# Altium schematic sheet Drivers_V2.SchDoc
size A4
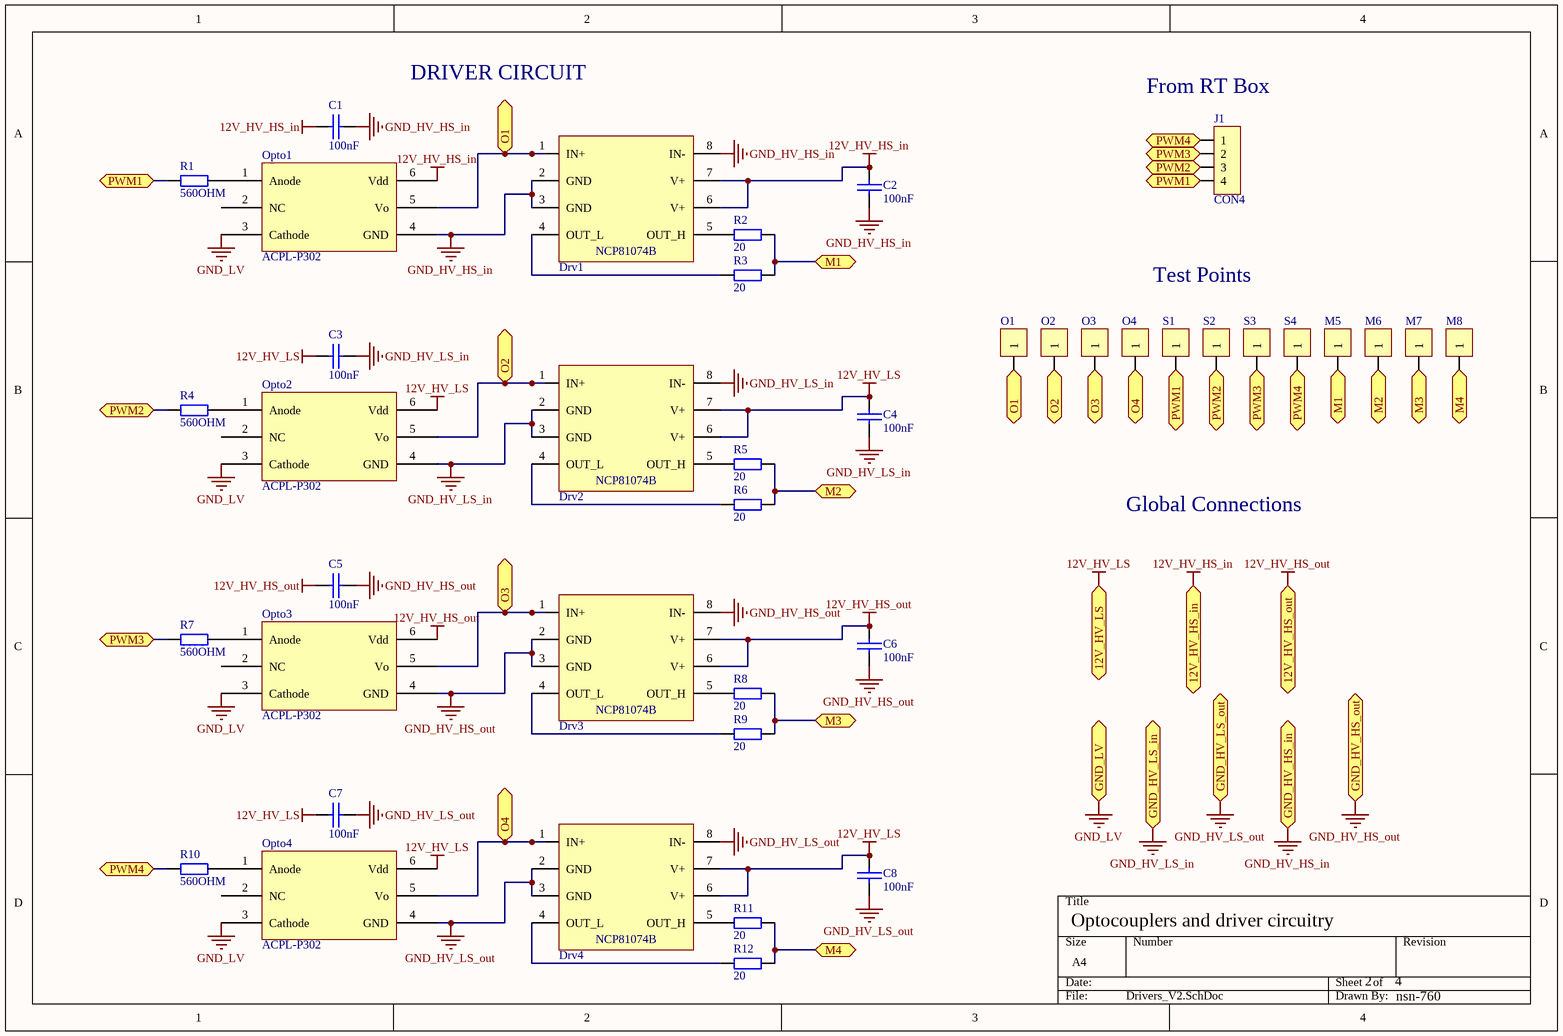
[diagram p0: Drivers_V2.SchDoc]

## Parts
C1  100nF  [1206]
C2  100nF  [1206]
C3  100nF  [1206]
C4  100nF  [1206]
C5  100nF  [1206]
C6  100nF  [1206]
C7  100nF  [1206]
C8  100nF  [1206]
Drv1  NCP81074B  [NCP81074A]  (value not drawn)
Drv2  NCP81074B  [NCP81074A]  (value not drawn)
Drv3  NCP81074B  [NCP81074A]  (value not drawn)
Drv4  NCP81074B  [NCP81074A]  (value not drawn)
J1  CON4  [Con4_Extron _3.5mmPitch]
M5  Test Point  [Test_Point]  (value not drawn)
M6  Test Point  [Test_Point]  (value not drawn)
M7  Test Point  [Test_Point]  (value not drawn)
M8  Test Point  [Test_Point]  (value not drawn)
O1  Test Point  [Test_Point]  (value not drawn)
O2  Test Point  [Test_Point]  (value not drawn)
O3  Test Point  [Test_Point]  (value not drawn)
O4  Test Point  [Test_Point]  (value not drawn)
Opto1  ACPL-P302  [SSOIC6]
Opto2  ACPL-P302  [SSOIC6]
Opto3  ACPL-P302  [SSOIC6]
Opto4  ACPL-P302  [SSOIC6]
R1  560OHM  [1206]
R2  20  [1206]
R3  20  [1206]
R4  560OHM  [1206]
R5  20  [1206]
R6  20  [1206]
R7  560OHM  [1206]
R8  20  [1206]
R9  20  [1206]
R10  560OHM  [1206]
R11  20  [1206]
R12  20  [1206]
S1  Test Point  [Test_Point]  (value not drawn)
S2  Test Point  [Test_Point]  (value not drawn)
S3  Test Point  [Test_Point]  (value not drawn)
S4  Test Point  [Test_Point]  (value not drawn)

## Ports
12V_HV_HS_in, 12V_HV_HS_out, 12V_HV_LS, GND_HV_HS_in, GND_HV_HS_out, GND_HV_LS_in, GND_HV_LS_out, GND_LV, M1, M2, M3, M4, O1, O2, O3, O4, PWM1, PWM2, PWM3, PWM4

## Nets
12V_HV_HS_in: C1.1 C2.1 Drv1.6(V+) Drv1.7(V+) Opto1.6(Vdd) ; port 12V_HV_HS_in
12V_HV_HS_out: C5.1 C6.1 Drv3.6(V+) Drv3.7(V+) Opto3.6(Vdd) ; port 12V_HV_HS_out
12V_HV_LS: C3.1 C4.1 C7.1 C8.1 Drv2.6(V+) Drv2.7(V+) Drv4.6(V+) Drv4.7(V+) Opto2.6(Vdd) Opto4.6(Vdd) ; port 12V_HV_LS
GND_HV_HS_in: C1.2 C2.2 Drv1.2(GND) Drv1.3(GND) Drv1.8(IN-) Opto1.4(GND) ; port GND_HV_HS_in
GND_HV_HS_out: C5.2 C6.2 Drv3.2(GND) Drv3.3(GND) Drv3.8(IN-) Opto3.4(GND) ; port GND_HV_HS_out
GND_HV_LS_in: C3.2 C4.2 Drv2.2(GND) Drv2.3(GND) Drv2.8(IN-) Opto2.4(GND) ; port GND_HV_LS_in
GND_HV_LS_out: C7.2 C8.2 Drv4.2(GND) Drv4.3(GND) Drv4.8(IN-) Opto4.4(GND) ; port GND_HV_LS_out
GND_LV: Opto1.3(Cathode) Opto2.3(Cathode) Opto3.3(Cathode) Opto4.3(Cathode) ; port GND_LV
M1: M5.1 R2.1 R3.1 ; port M1
M2: M6.1 R5.1 R6.1 ; port M2
M3: M7.1 R8.1 R9.1 ; port M3
M4: M8.1 R11.1 R12.1 ; port M4
O1: Drv1.1(IN+) O1.1 Opto1.5(Vo) ; port O1
O2: Drv2.1(IN+) O2.1 Opto2.5(Vo) ; port O2
O3: Drv3.1(IN+) O3.1 Opto3.5(Vo) ; port O3
O4: Drv4.1(IN+) O4.1 Opto4.5(Vo) ; port O4
PWM1: J1.4 R1.2 S1.1 ; port PWM1
PWM2: J1.3 R4.2 S2.1 ; port PWM2
PWM3: J1.2 R7.2 S3.1 ; port PWM3
PWM4: J1.1 R10.2 S4.1 ; port PWM4
NetDrv1_4: Drv1.4(OUT_L) R3.2
NetDrv1_5: Drv1.5(OUT_H) R2.2
NetDrv2_4: Drv2.4(OUT_L) R6.2
NetDrv2_5: Drv2.5(OUT_H) R5.2
NetDrv3_4: Drv3.4(OUT_L) R9.2
NetDrv3_5: Drv3.5(OUT_H) R8.2
NetDrv4_4: Drv4.4(OUT_L) R12.2
NetDrv4_5: Drv4.5(OUT_H) R11.2
NetOpto1_1: Opto1.1(Anode) R1.1
NetOpto2_1: Opto2.1(Anode) R4.1
NetOpto3_1: Opto3.1(Anode) R7.1
NetOpto4_1: Opto4.1(Anode) R10.1

Not connected (* = marked no-connect by the designer): Opto1 2(NC); Opto2 2(NC); Opto3 2(NC); Opto4 2(NC)

## Notes on the sheet
- DRIVER CIRCUIT
- (near J1) From RT Box
- Test Points
- Global Connections
- Optocouplers and driver circuitry
- 2
- 4
- nsn-760

## Library data of the parts
C1-C8 = Condensador
Opto1-Opto4 = Opto_ACPL
R1-R12 = Resistencia: Potencia: 1/4W